# Altium schematic sheet Bluetooth_Module_1R1.SchDoc: Bluetooth Module
size A4; Author: Harris Tomy & Neil Patil; Organization: The University of Auckland; Address1: Room XXX, Building 405; Address2: 20 Symonds Street; Address3: Auckland; Address4: New Zealand; Revision: 1R0; SheetNumber: 1; SheetTotal: 1
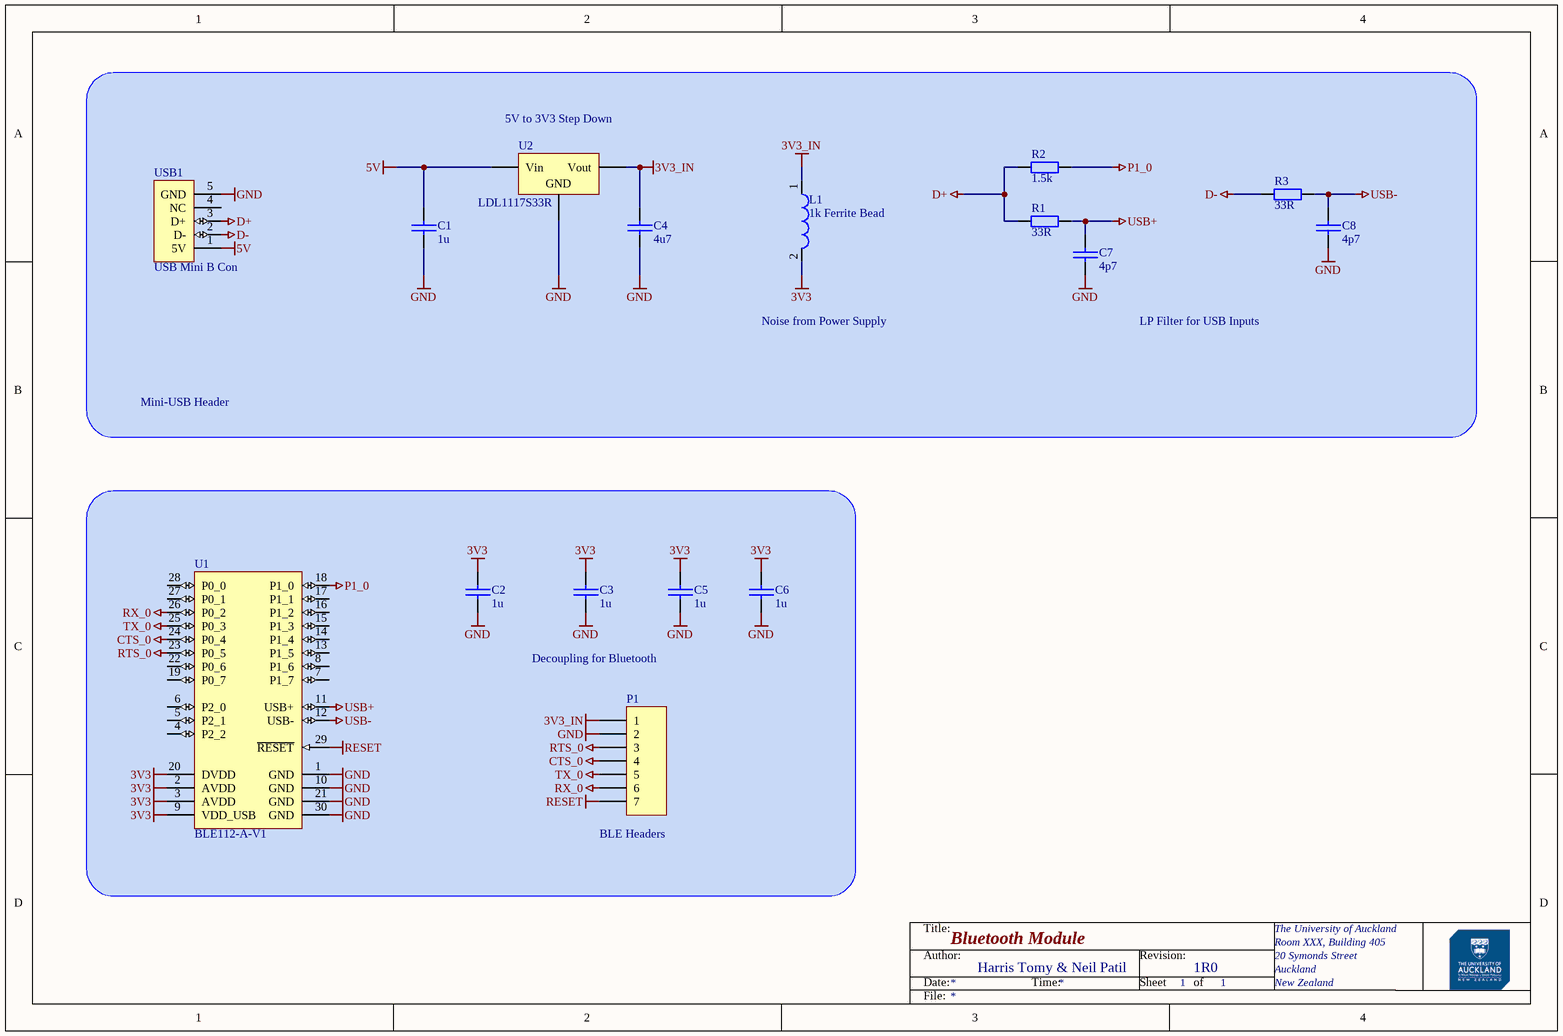
[diagram p0: Bluetooth_Module_1R1.SchDoc]

## Parts
C1  1u  [C0805]
C2  1u  [C0805]
C3  1u  [C0805]
C4  4u7  [C1206]
C5  1u  [C0805]
C6  1u  [C0805]
C7  4p7  [C0805]
C8  4p7  [C0805]
L1  1k Ferrite Bead  [SMD-1206]
P1  BLE Headers  [HDR1X7]
R1  value 33R  [R0805]  (hidden comment: Resistor 0805)
R2  value 1.5k  [R0805]  (hidden comment: Resistor 0805)
R3  value 33R  [R0805]  (hidden comment: Resistor 0805)
U1  BLE112-A-V1  [BLUE-BLE112-A-V1_V]
U2  LDL1117S33R  [SOT223L]
USB1  USB Mini B Con  [USB_UJ2MAB]

## Blocks framed on the sheet
Decoupling for Bluetooth: C2 C3 C5 C6 P1 U1

## Nets
3V3: C2.2 C3.2 C5.2 C6.2 L1.2 U1.2(AVDD) U1.3(AVDD) U1.9(VDD_USB) U1.20(DVDD)
3V3_IN: C4.2 L1.1 P1.1 U2.2(Vout)
5V: C1.2 U2.3(Vin) USB1.1(5V)
CTS_0: P1.4 U1.24(P0_4)
D+: R1.2 R2.1 USB1.3(D+)
D-: R3.2 USB1.2(D-)
GND: C1.1 C2.1 C3.1 C4.1 C5.1 C6.1 C7.1 C8.1 P1.2 U1.1(GND) U1.10(GND) U1.21(GND) U1.30(GND) U2.1(GND) USB1.5(GND)
P1_0: R2.2 U1.18(P1_0)
RESET: P1.7 U1.29(~{RESET})
RTS_0: P1.3 U1.23(P0_5)
RX_0: P1.6 U1.26(P0_2)
TX_0: P1.5 U1.25(P0_3)
USB+: C7.2 R1.1 U1.11(USB+)
USB-: C8.2 R3.1 U1.12(USB-)

Not connected (* = marked no-connect by the designer): U1 4(P2_2) 5(P2_1) 6(P2_0) 7(P1_7) 8(P1_6) 13(P1_5) 14(P1_4) 15(P1_3) 16(P1_2) 17(P1_1) 19(P0_7) 22(P0_6) 27(P0_1) 28(P0_0); USB1 4(NC)

## Notes on the sheet
- (near U2) 5V to 3V3 Step Down
- Noise from Power Supply
- LP Filter for USB Inputs
- Mini-USB Header
- Title:
- Author:
- Date:
- Time:
- Revision:
- Sheet
- of
- File:

## Library data of the parts
C1-C3 C5-C8 = CCAP0805: Type: Surface Mount; MPN: ?; Part Description: ?; Value: ?
C4 = Cap CER Decoup C3216C0G2A104J160AC: CAP CER 0.1UF 100V C0G 1206; Manufacturer: TDK Corporation; Type: Surface mount; Value: 100nF/100V; MPN: C3216C0G2A104J160AC; Part Description: CAP CER 0.1UF 100V C0G 1206; Supplier 1: RSComponents; Supplier Part Number 1: 1795799; Supplier 2: Element14; Supplier Part Number 4: 810-C3216C0G2A104J6C; Supplier Part Number 3: 445-172677-1-ND; Supplier Part Number 2: 2906828; Supplier 4: Mouser; Supplier 3: Digi-Key
L1 = 742792113: SMD EMI Suppression Ferrite Bead WE-CBF, Z = 120 Ohm; Impedance: 120 Ohm; ComponentLink1Description: Manufacturer Link; ComponentLink2Description: Datasheet; DatasheetVersion: Dec-2005; ComponentLink1URL: http://www.we-online.com; PackageVersion: 2007; PackageDescription: Chip Inductor, 2-Leads, Body 3.2 x 1.6 mm; ComponentLink2URL: http://www.we-online.de/katalog/media/pdf/742792113.pdf; PackageReference: SMD-1206; PartNumber: 742792113
P1 = Header 7: Header, 7-Pin; LatestRevisionDate: 17-Jul-2002; LatestRevisionNote: Re-released for DXP Platform.; Publisher: Altium Limited
R1-R3 = RES0805: MPN: ?; Part Description: ?; Type: Surface Mount
U1 = BLE112-A-V1: Bluetooth(R) Low Energy Single Mode Module / , 2 to 3.6 V, -40 to 85 degC, 30-Pin SMD, RoHS, Tape and Reel; Min Supply Voltage: 2.1 V; Max Supply Voltage: 3.6 V; RoHSCompliant: true; ComponentLink1Description: Manufacturer URL; Min Operating Temperature: -40 degC; ComponentLink2Description: Datasheet; DatasheetVersion: Rev. 1.4, 05/2013; ComponentLink1URL: www.bluegiga.com; Packaging: Cut Tape; Pins: 64; REACH SVHC: No SVHC; Max Operating Temperature: 85 degC; PackageDescription: 30-Pin Surface Mount Device, Body 12.05 x 18.1 mm, Pitch 1.25 mm; ComponentLink2URL: http://www.mouser.com/ds/2/368/Bluegiga_Technologies_BLE112_Datasheet-558666.pdf; PackageReference: BLE112-A-V1; PartNumber: BLE112-A-V1
U2 = LDO LDL1117S33R: IC REG LINEAR 3.3V 1.2A SOT223; Manufacturer: STMicroelectronics; Value: 3.3V/1.2A; MPN: LDL1117S33R; Supplier 1: Element14; Type: Surface mount; Part Description: IC REG LINEAR 3.3V 1.2A SOT223; Supplier Part Number 3: 511-LDL1117S33R; Supplier Part Number 2: 497-17239-1-ND; Supplier Part Number 1: 2729708; Supplier 3: Mouser; Supplier 2: Digi-Key
USB1 = USBMiniB: Supplier 1: Digi-Key; Supplier Part Number 1: 102-4004-1-ND